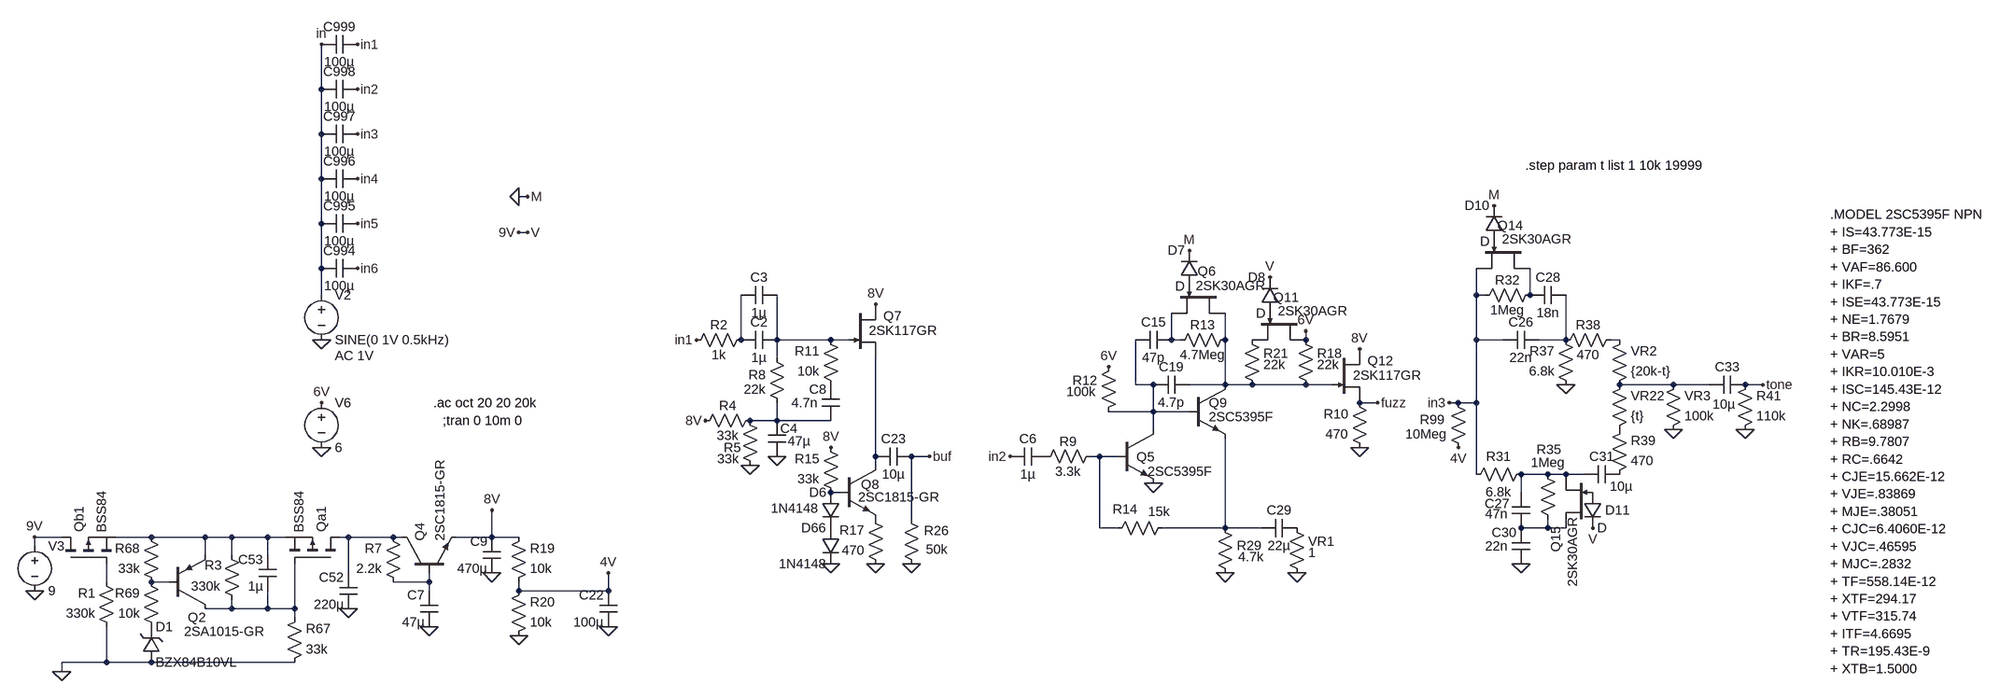
[diagram p0: schematic fz1w.asc]
fz1w.asc, the LTspice schematic file:
Version 4
SHEET 1 3148 2364
WIRE -4528 1072 -4528 992
WIRE -4528 1152 -4528 1072
WIRE -4528 1232 -4528 1152
WIRE -4160 1264 -4176 1264
WIRE -4528 1312 -4528 1232
WIRE -4160 1328 -4176 1328
WIRE -4528 1392 -4528 1312
WIRE -4528 1440 -4528 1392
WIRE -2432 1440 -2432 1392
WIRE -2416 1440 -2432 1440
WIRE -2336 1440 -2336 1392
WIRE -3744 1520 -3744 1440
WIRE -3680 1520 -3680 1440
WIRE -3584 1520 -3680 1520
WIRE -3552 1520 -3584 1520
WIRE -2976 1520 -2976 1472
WIRE -2960 1520 -2976 1520
WIRE -2880 1520 -2880 1472
WIRE -2736 1520 -2736 1504
WIRE -2432 1520 -2432 1440
WIRE -2384 1520 -2432 1520
WIRE -2272 1520 -2272 1440
WIRE -2272 1520 -2320 1520
WIRE -2176 1520 -2192 1520
WIRE -3680 1552 -3680 1520
WIRE -3040 1600 -3040 1520
WIRE -3008 1600 -3040 1600
WIRE -2880 1600 -2880 1520
WIRE -2880 1600 -2944 1600
WIRE -2832 1600 -2880 1600
WIRE -2736 1600 -2832 1600
WIRE -2688 1600 -2736 1600
WIRE -2080 1600 -2176 1600
WIRE -2016 1600 -2080 1600
WIRE -1920 1600 -1952 1600
WIRE -2608 1632 -2640 1632
WIRE -2464 1632 -2480 1632
WIRE -2432 1632 -2432 1520
WIRE -2432 1632 -2464 1632
WIRE -3008 1648 -3008 1600
WIRE -3008 1648 -3088 1648
WIRE -2944 1648 -3008 1648
WIRE -3680 1664 -3680 1632
WIRE -3680 1664 -3728 1664
WIRE -3584 1664 -3680 1664
WIRE -3008 1680 -3008 1648
WIRE -3504 1728 -3504 1552
WIRE -3408 1728 -3440 1728
WIRE -3104 1728 -3120 1728
WIRE -3072 1728 -3104 1728
WIRE -3504 1744 -3504 1728
WIRE -2432 1760 -2432 1632
WIRE -2304 1760 -2352 1760
WIRE -2272 1760 -2304 1760
WIRE -2240 1760 -2272 1760
WIRE -3568 1792 -3584 1792
WIRE -2352 1792 -2352 1760
WIRE -3440 1840 -3440 1728
WIRE -3104 1856 -3104 1728
WIRE -3072 1856 -3104 1856
WIRE -2880 1856 -2880 1696
WIRE -2880 1856 -2992 1856
WIRE -2816 1856 -2880 1856
WIRE -2304 1856 -2304 1840
WIRE -2304 1856 -2352 1856
WIRE -2272 1856 -2304 1856
WIRE -4992 1872 -5040 1872
WIRE -4832 1872 -4896 1872
WIRE -4736 1872 -4832 1872
WIRE -4688 1872 -4736 1872
WIRE -4624 1872 -4688 1872
WIRE -4592 1872 -4624 1872
WIRE -4480 1872 -4496 1872
WIRE -4400 1872 -4480 1872
WIRE -4384 1872 -4400 1872
WIRE -4224 1872 -4224 1824
WIRE -4224 1872 -4288 1872
WIRE -4176 1872 -4224 1872
WIRE -5040 1888 -5040 1872
WIRE -4736 1904 -4736 1872
WIRE -4688 1904 -4688 1872
WIRE -4624 1904 -4624 1872
WIRE -4480 1936 -4480 1872
WIRE -4912 1952 -4912 1920
WIRE -4800 1952 -4832 1952
WIRE -4336 1952 -4336 1936
WIRE -4336 1952 -4400 1952
WIRE -4336 1968 -4336 1952
WIRE -4176 1968 -4176 1952
WIRE -4016 1968 -4016 1936
WIRE -4016 1968 -4176 1968
WIRE -4688 2000 -4688 1984
WIRE -4688 2000 -4736 2000
WIRE -4624 2000 -4624 1968
WIRE -4624 2000 -4688 2000
WIRE -4576 2000 -4576 1920
WIRE -4576 2000 -4624 2000
WIRE -4576 2016 -4576 2000
WIRE -4912 2096 -4912 2032
WIRE -4912 2096 -4992 2096
WIRE -4832 2096 -4912 2096
WIRE -4576 2096 -4832 2096
WIRE -4992 2112 -4992 2096
FLAG -4336 2032 0
FLAG -4224 1936 0
FLAG -4224 1824 8V
FLAG -4176 2048 0
FLAG -4016 2032 0
FLAG -4016 1936 4V
FLAG -5040 1872 9V
FLAG -4992 2112 0
FLAG -5040 1968 0
FLAG -3504 1920 0
FLAG -3584 1920 0
FLAG -3504 1456 8V
FLAG -3728 1744 0
FLAG -3680 1728 0
FLAG -3584 1712 8V
FLAG -3008 1776 0
FLAG -2880 1936 0
FLAG -2736 1504 6V
FLAG -3440 1920 0
FLAG -3808 1664 8V
FLAG -2752 1936 0
FLAG -2640 1536 8V
FLAG -2640 1712 0
FLAG -4528 1712 0
FLAG -4528 1632 6V
FLAG -4480 2000 0
FLAG -4528 1520 0
FLAG -4528 992 in
FLAG -4464 992 in1
FLAG -4464 1072 in2
FLAG -4464 1152 in3
FLAG -4464 1232 in4
FLAG -4464 1312 in5
FLAG -4464 1392 in6
FLAG -3824 1520 in1
FLAG -3088 1568 6V
FLAG -2800 1408 V
FLAG -2944 1360 M
FLAG -3264 1728 in2
FLAG -2272 1600 0
FLAG -2352 1920 0
FLAG -1952 1680 0
FLAG -2080 1680 0
FLAG -2480 1632 in3
FLAG -2224 1856 V
FLAG -2400 1280 M
FLAG -4160 1328 V
FLAG -4160 1264 M
FLAG -4176 1264 0
FLAG -4176 1328 9V
FLAG -2464 1712 4V
FLAG -3408 1728 buf
FLAG -2608 1632 fuzz
FLAG -1920 1600 tone
SYMBOL npn -4384 1936 R270
SYMATTR InstName Q4
SYMATTR Value 2SC1815-GR
SYMBOL res -4384 1968 R180
WINDOW 0 36 76 Left 2
WINDOW 3 36 40 Left 2
SYMATTR InstName R7
SYMATTR Value 2.2k
SYMBOL cap -4320 2032 R180
WINDOW 0 24 56 Left 2
WINDOW 3 24 8 Left 2
SYMATTR InstName C7
SYMATTR Value 47µ
SYMBOL cap -4208 1936 R180
WINDOW 0 24 56 Left 2
WINDOW 3 24 8 Left 2
SYMATTR InstName C9
SYMATTR Value 470µ
SYMBOL res -4192 1968 M180
WINDOW 0 36 76 Left 2
WINDOW 3 36 40 Left 2
SYMATTR InstName R19
SYMATTR Value 10k
SYMBOL res -4192 2064 M180
WINDOW 0 36 76 Left 2
WINDOW 3 36 40 Left 2
SYMATTR InstName R20
SYMATTR Value 10k
SYMBOL cap -4000 2032 R180
WINDOW 0 24 56 Left 2
WINDOW 3 24 8 Left 2
SYMATTR InstName C22
SYMATTR Value 100µ
SYMBOL pmos -4992 1920 R270
SYMATTR InstName Qb1
SYMATTR Value BSS84
SYMBOL res -4896 2048 R180
WINDOW 0 36 76 Left 2
WINDOW 3 36 40 Left 2
SYMATTR InstName R1
SYMATTR Value 330k
SYMBOL pnp -4800 2000 M180
WINDOW 0 33 -16 Left 2
WINDOW 3 27 -41 Left 2
SYMATTR InstName Q2
SYMATTR Value 2SA1015-GR
SYMBOL res -4816 1968 R180
WINDOW 0 36 76 Left 2
WINDOW 3 36 40 Left 2
SYMATTR InstName R68
SYMATTR Value 33k
SYMBOL res -4816 2048 R180
WINDOW 0 36 76 Left 2
WINDOW 3 36 40 Left 2
SYMATTR InstName R69
SYMATTR Value 10k
SYMBOL zener -4848 2096 M180
WINDOW 0 24 64 Left 2
WINDOW 3 24 0 Left 2
SYMATTR InstName D1
SYMATTR Value BZX84B10VL
SYMATTR Description Diode
SYMATTR Type diode
SYMBOL res -4672 2000 R180
WINDOW 0 34 78 Left 2
WINDOW 3 36 40 Left 2
SYMATTR InstName R3
SYMATTR Value 330k
SYMBOL cap -4608 1968 R180
WINDOW 0 24 56 Left 2
WINDOW 3 24 8 Left 2
SYMATTR InstName C53
SYMATTR Value 1µ
SYMBOL res -4592 2112 M180
WINDOW 0 36 76 Left 2
WINDOW 3 36 40 Left 2
SYMATTR InstName R67
SYMATTR Value 33k
SYMBOL pmos -4496 1920 M270
SYMATTR InstName Qa1
SYMATTR Value BSS84
SYMBOL njf -3552 1456 R0
WINDOW 3 36 47 Left 2
WINDOW 0 62 21 Left 2
SYMATTR Value 2SK117GR
SYMATTR InstName Q7
SYMBOL npn -3568 1744 R0
WINDOW 0 38 34 Left 2
WINDOW 3 33 57 Left 2
SYMATTR InstName Q8
SYMATTR Value 2SC1815-GR
SYMBOL cap -3440 1712 R90
WINDOW 0 0 32 VBottom 2
WINDOW 3 32 32 VTop 2
SYMATTR InstName C23
SYMATTR Value 10µ
SYMBOL res -3488 1936 R180
WINDOW 0 36 76 Left 2
WINDOW 3 36 40 Left 2
SYMATTR InstName R17
SYMATTR Value 470
SYMBOL diode -3568 1792 M0
WINDOW 3 38 29 Left 2
SYMATTR Value 1N4148
SYMATTR InstName D6
SYMBOL diode -3568 1856 M0
SYMATTR InstName D66
SYMATTR Value 1N4148
SYMBOL res -3568 1616 R180
WINDOW 0 36 76 Left 2
WINDOW 3 36 40 Left 2
SYMATTR InstName R11
SYMATTR Value 10k
SYMBOL cap -3568 1664 R180
WINDOW 0 24 56 Left 2
WINDOW 3 39 32 Left 2
SYMATTR InstName C8
SYMATTR Value 4.7n
SYMBOL res -3664 1648 R180
WINDOW 0 36 66 Left 2
WINDOW 3 36 40 Left 2
SYMATTR InstName R8
SYMATTR Value 22k
SYMBOL res -3712 1760 R180
WINDOW 0 32 48 Left 2
WINDOW 3 36 28 Left 2
SYMATTR InstName R5
SYMATTR Value 33k
SYMBOL res -3712 1648 R90
WINDOW 0 5 56 VBottom 2
WINDOW 3 27 56 VTop 2
SYMATTR InstName R4
SYMATTR Value 33k
SYMBOL cap -3664 1728 R180
WINDOW 0 -21 50 Left 2
WINDOW 3 -44 27 Left 2
SYMATTR InstName C4
SYMATTR Value 47µ
SYMBOL cap -3680 1504 R90
WINDOW 0 0 32 VBottom 2
WINDOW 3 32 32 VTop 2
SYMATTR InstName C2
SYMATTR Value 1µ
SYMBOL cap -3680 1424 R90
WINDOW 0 0 32 VBottom 2
WINDOW 3 32 32 VTop 2
SYMATTR InstName C3
SYMATTR Value 1µ
SYMBOL res -3728 1504 R90
WINDOW 0 5 56 VBottom 2
WINDOW 3 27 56 VTop 2
SYMATTR InstName R2
SYMATTR Value 1k
SYMBOL res -3568 1808 R180
WINDOW 0 36 76 Left 2
WINDOW 3 36 40 Left 2
SYMATTR InstName R15
SYMATTR Value 33k
SYMBOL res -3072 1552 M0
WINDOW 3 39 60 Left 2
SYMATTR Value 100k
SYMATTR InstName R12
SYMBOL res -2976 1840 R90
WINDOW 0 -2 83 VBottom 2
WINDOW 3 -29 22 VTop 2
SYMATTR InstName R14
SYMATTR Value 15k
SYMBOL res -2896 1840 R0
WINDOW 0 37 47 Left 2
WINDOW 3 39 67 Left 2
SYMATTR InstName R29
SYMATTR Value 4.7k
SYMBOL npn -2944 1600 R0
WINDOW 0 35 32 Left 2
WINDOW 3 35 57 Left 2
SYMATTR InstName Q9
SYMATTR Value 2SC5395F
SYMBOL npn -3072 1680 R0
WINDOW 0 34 49 Left 2
WINDOW 3 54 75 Left 2
SYMATTR InstName Q5
SYMATTR Value 2SC5395F
SYMBOL res -3104 1712 R90
WINDOW 0 5 56 VBottom 2
WINDOW 3 27 56 VTop 2
SYMATTR InstName R9
SYMATTR Value 3.3k
SYMBOL cap -3200 1712 R90
WINDOW 0 0 32 VBottom 2
WINDOW 3 32 32 VTop 2
SYMATTR InstName C6
SYMATTR Value 1µ
SYMBOL res -3424 1936 R180
WINDOW 0 -51 75 Left 2
WINDOW 3 -49 42 Left 2
SYMATTR InstName R26
SYMATTR Value 50k
SYMBOL cap -2752 1840 R90
WINDOW 0 0 32 VBottom 2
WINDOW 3 32 32 VTop 2
SYMATTR InstName C29
SYMATTR Value 22µ
SYMBOL njf -2688 1536 R0
WINDOW 3 36 47 Left 2
WINDOW 0 62 21 Left 2
SYMATTR Value 2SK117GR
SYMATTR InstName Q12
SYMBOL res -2624 1728 R180
WINDOW 0 36 76 Left 2
WINDOW 3 36 40 Left 2
SYMATTR InstName R10
SYMATTR Value 470
SYMBOL cap -2320 1504 R90
WINDOW 0 0 32 VBottom 2
WINDOW 3 32 32 VTop 2
SYMATTR InstName C26
SYMATTR Value 22n
SYMBOL voltage -4528 1616 R0
WINDOW 123 0 0 Left 0
WINDOW 39 0 0 Left 0
SYMATTR InstName V6
SYMATTR Value 6
SYMBOL cap -4464 2000 R180
WINDOW 0 24 56 Left 2
WINDOW 3 24 8 Left 2
SYMATTR InstName C52
SYMATTR Value 220µ
SYMBOL voltage -5040 1872 R0
WINDOW 123 0 0 Left 0
WINDOW 39 0 0 Left 0
SYMATTR InstName V3
SYMATTR Value 9
SYMBOL voltage -4528 1424 R0
WINDOW 123 24 124 Left 2
WINDOW 39 0 0 Left 2
SYMATTR Value2 AC 1V
SYMATTR InstName V2
SYMATTR Value SINE(0 1V 0.5kHz)
SYMBOL cap -4464 1056 R90
WINDOW 0 0 32 VBottom 2
WINDOW 3 32 32 VTop 2
SYMATTR InstName C998
SYMATTR Value 100µ
SYMBOL cap -4464 1136 R90
WINDOW 0 0 32 VBottom 2
WINDOW 3 32 32 VTop 2
SYMATTR InstName C997
SYMATTR Value 100µ
SYMBOL cap -4464 1216 R90
WINDOW 0 0 32 VBottom 2
WINDOW 3 32 32 VTop 2
SYMATTR InstName C996
SYMATTR Value 100µ
SYMBOL cap -4464 976 R90
WINDOW 0 0 32 VBottom 2
WINDOW 3 32 32 VTop 2
SYMATTR InstName C999
SYMATTR Value 100µ
SYMBOL cap -4464 1296 R90
WINDOW 0 0 32 VBottom 2
WINDOW 3 32 32 VTop 2
SYMATTR InstName C995
SYMATTR Value 100µ
SYMBOL cap -4464 1376 R90
WINDOW 0 0 32 VBottom 2
WINDOW 3 32 32 VTop 2
SYMATTR InstName C994
SYMATTR Value 100µ
SYMBOL res -2768 1840 R0
WINDOW 3 36 60 Left 2
SYMATTR Value 1
SYMATTR InstName VR1
SYMBOL njf -2880 1424 R90
WINDOW 3 -1 -71 VRight 2
WINDOW 0 -27 17 VRight 2
SYMATTR Value 2SK30AGR
SYMATTR InstName Q6
SYMBOL cap -2944 1584 R90
WINDOW 0 0 32 VBottom 2
WINDOW 3 32 32 VTop 2
SYMATTR InstName C19
SYMATTR Value 4.7p
SYMBOL res -2864 1504 R90
WINDOW 0 5 56 VBottom 2
WINDOW 3 27 56 VTop 2
SYMATTR InstName R13
SYMATTR Value 4.7Meg
SYMBOL cap -2976 1504 R90
WINDOW 0 0 32 VBottom 2
WINDOW 3 32 32 VTop 2
SYMATTR InstName C15
SYMATTR Value 47p
SYMBOL njf -2736 1472 R90
WINDOW 3 -4 -74 VRight 2
WINDOW 0 -28 12 VRight 2
SYMATTR Value 2SK30AGR
SYMATTR InstName Q11
SYMBOL res -2752 1504 R0
WINDOW 3 36 60 Left 2
SYMATTR Value 22k
SYMATTR InstName R18
SYMBOL res -2848 1504 R0
WINDOW 3 36 60 Left 2
SYMATTR Value 22k
SYMATTR InstName R21
SYMBOL cap -2272 1424 R90
WINDOW 0 0 32 VBottom 2
WINDOW 3 32 32 VTop 2
SYMATTR InstName C28
SYMATTR Value 18n
SYMBOL res -2256 1616 R180
WINDOW 0 36 76 Left 2
WINDOW 3 36 40 Left 2
SYMATTR InstName R37
SYMATTR Value 6.8k
SYMBOL res -2320 1424 R90
WINDOW 0 5 56 VBottom 2
WINDOW 3 27 56 VTop 2
SYMATTR InstName R32
SYMATTR Value 1Meg
SYMBOL cap -2336 1920 R180
WINDOW 0 24 56 Left 2
WINDOW 3 39 32 Left 2
SYMATTR InstName C30
SYMATTR Value 22n
SYMBOL cap -2336 1856 R180
WINDOW 0 36 44 Left 2
WINDOW 3 39 25 Left 2
SYMATTR InstName C27
SYMATTR Value 47n
SYMBOL cap -2176 1744 R90
WINDOW 0 0 32 VBottom 2
WINDOW 3 22 -3 VTop 2
SYMATTR InstName C31
SYMATTR Value 10µ
SYMBOL res -2288 1856 R180
WINDOW 0 -8 140 Left 2
WINDOW 3 -15 117 Left 2
SYMATTR InstName R35
SYMATTR Value 1Meg
SYMBOL njf -2336 1344 R90
WINDOW 3 -4 -74 VRight 2
WINDOW 0 -28 12 VRight 2
SYMATTR Value 2SK30AGR
SYMATTR InstName Q14
SYMBOL res -2176 1504 R90
WINDOW 0 5 56 VBottom 2
WINDOW 3 27 56 VTop 2
SYMATTR InstName R38
SYMATTR Value 470
SYMBOL njf -2224 1856 R180
WINDOW 3 35 -105 VRight 2
WINDOW 0 65 -44 VRight 2
SYMATTR Value 2SK30AGR
SYMATTR InstName Q15
SYMBOL res -2192 1616 M180
WINDOW 0 36 76 Left 2
WINDOW 3 36 40 Left 2
SYMATTR InstName VR2
SYMATTR Value {20k-t}
SYMBOL res -2192 1696 M180
WINDOW 0 36 76 Left 2
WINDOW 3 36 40 Left 2
SYMATTR InstName VR22
SYMATTR Value {t}
SYMBOL res -2192 1776 M180
WINDOW 0 36 76 Left 2
WINDOW 3 36 40 Left 2
SYMATTR InstName R39
SYMATTR Value 470
SYMBOL cap -1952 1584 R90
WINDOW 0 0 32 VBottom 2
WINDOW 3 35 38 VTop 2
SYMATTR InstName C33
SYMATTR Value 10µ
SYMBOL res -1968 1696 M180
WINDOW 0 36 76 Left 2
WINDOW 3 36 40 Left 2
SYMATTR InstName R41
SYMATTR Value 110k
SYMBOL res -2096 1696 M180
WINDOW 0 36 76 Left 2
WINDOW 3 36 40 Left 2
SYMATTR InstName VR3
SYMATTR Value 100k
SYMBOL res -2448 1728 R180
WINDOW 0 40 66 Left 2
WINDOW 3 36 40 Left 2
SYMATTR InstName R99
SYMATTR Value 10Meg
SYMBOL diode -2928 1424 R180
WINDOW 0 24 64 Left 2
WINDOW 3 24 0 Left 2
SYMATTR InstName D7
SYMBOL diode -2384 1344 R180
WINDOW 0 24 64 Left 2
WINDOW 3 24 0 Left 2
SYMATTR InstName D10
SYMBOL diode -2784 1472 R180
WINDOW 0 24 64 Left 2
WINDOW 3 24 0 Left 2
SYMATTR InstName D8
SYMBOL diode -2240 1792 R0
WINDOW 0 38 32 Left 2
SYMATTR InstName D11
SYMBOL res -2448 1776 R270
WINDOW 0 32 56 VTop 2
WINDOW 3 0 56 VBottom 2
SYMATTR InstName R31
SYMATTR Value 6.8k
TEXT -4328 1632 Left 2 !.ac oct 20 20 20k
TEXT -4312 1664 Left 2 !;tran 0 10m 0
TEXT -2344 1208 Left 2 !.step param t list 1 10k 19999
TEXT -1800 1296 Left 2 !.MODEL 2SC5395F NPN\n+ IS=43.773E-15\n+ BF=362\n+ VAF=86.600\n+ IKF=.7\n+ ISE=43.773E-15\n+ NE=1.7679\n+ BR=8.5951\n+ VAR=5\n+ IKR=10.010E-3\n+ ISC=145.43E-12\n+ NC=2.2998\n+ NK=.68987\n+ RB=9.7807\n+ RC=.6642\n+ CJE=15.662E-12\n+ VJE=.83869\n+ MJE=.38051\n+ CJC=6.4060E-12\n+ VJC=.46595\n+ MJC=.2832\n+ TF=558.14E-12\n+ XTF=294.17\n+ VTF=315.74\n+ ITF=4.6695\n+ TR=195.43E-9\n+ XTB=1.5000

The netlist it stands for:
* fz1w.asc
Q4 N018 N021 8V 0 2SC1815-GR
R7 N021 N018 2.2k
C7 0 N021 47µ
C9 0 8V 470µ
R19 4V 8V 10k
R20 0 4V 10k
C22 0 4V 100µ
M§Qb1 V N019 N017 N017 BSS84
R1 0 N019 330k
Q2 N022 N020 N017 0 2SA1015-GR
R68 N020 N017 33k
R69 P001 N020 10k
D1 0 P001 BZX84B10VL
R3 N022 N017 330k
C53 N022 N017 1µ
R67 0 N022 33k
M§Qa1 N018 N022 N017 N017 BSS84
J§Q7 8V N003 N011 2SK117GR
Q8 N011 N014 P002 0 2SC1815-GR
C23 buf N011 10µ
R17 0 P002 470
D6 N014 P003 1N4148
D66 P003 0 1N4148
R11 P004 N003 10k
C8 N010 P004 4.7n
R8 N010 N003 22k
R5 0 N010 33k
R4 N010 8V 33k
C4 0 N010 47µ
C2 N003 N002 1µ
C3 N003 N002 1µ
R2 N002 in1 1k
R15 N014 8V 33k
R12 6V N008 100k
R14 N015 N012 15k
R29 N015 0 4.7k
Q9 N005 N008 N015 0 2SC5395F
Q5 N008 N012 0 0 2SC5395F
R9 N012 P005 3.3k
C6 P005 in2 1µ
R26 0 buf 50k
C29 P006 N015 22µ
J§Q12 8V N005 fuzz 2SK117GR
R10 0 fuzz 470
C26 N006 in3 22n
V6 6V 0 6
C52 0 N018 220µ
V3 V 0 9
V2 in 0 SINE(0 1V 0.5kHz) AC 1V
C998 in2 in 100µ
C997 in3 in 100µ
C996 in4 in 100µ
C999 in1 in 100µ
C995 in5 in 100µ
C994 in6 in 100µ
R§VR1 P006 0 1
J§Q6 N005 P007 N004 2SK30AGR
C19 N005 N008 4.7p
R13 N005 N004 4.7Meg
C15 N004 N008 47p
J§Q11 6V P008 P009 2SK30AGR
R18 6V N005 22k
R21 P009 N005 22k
C28 N006 N001 18n
R37 0 N006 6.8k
R32 N001 in3 1Meg
C30 0 N016 22n
C27 N016 N013 47n
C31 P010 N013 10µ
R35 N016 N013 1Meg
J§Q14 N001 P011 in3 2SK30AGR
R38 N007 N006 470
J§Q15 N016 P012 N013 2SK30AGR
R§VR2 N009 N007 {20k-t}
R§VR22 P013 N009 {t}
R39 P010 P013 470
C33 tone N009 10µ
R41 0 tone 110k
R§VR3 0 N009 100k
R99 4V in3 10Meg
D7 P007 0 D
D10 P011 0 D
D8 P008 V D
D11 P012 V D
R31 in3 N013 6.8k
.model D D
.lib standard.dio
.model NPN NPN
.model PNP PNP
.lib standard.bjt
.model NJF NJF
.model PJF PJF
.lib standard.jft
.model NMOS NMOS
.model PMOS PMOS
.lib standard.mos
.ac oct 20 20 20k
;tran 0 10m 0
.step param t list 1 10k 19999
.MODEL 2SC5395F NPN
+ IS=43.773E-15
+ BF=362
+ VAF=86.600
+ IKF=.7
+ ISE=43.773E-15
+ NE=1.7679
+ BR=8.5951
+ VAR=5
+ IKR=10.010E-3
+ ISC=145.43E-12
+ NC=2.2998
+ NK=.68987
+ RB=9.7807
+ RC=.6642
+ CJE=15.662E-12
+ VJE=.83869
+ MJE=.38051
+ CJC=6.4060E-12
+ VJC=.46595
+ MJC=.2832
+ TF=558.14E-12
+ XTF=294.17
+ VTF=315.74
+ ITF=4.6695
+ TR=195.43E-9
+ XTB=1.5000
.backanno
.end